# EAGLE design connector-test (EAGLE 9.1.2)
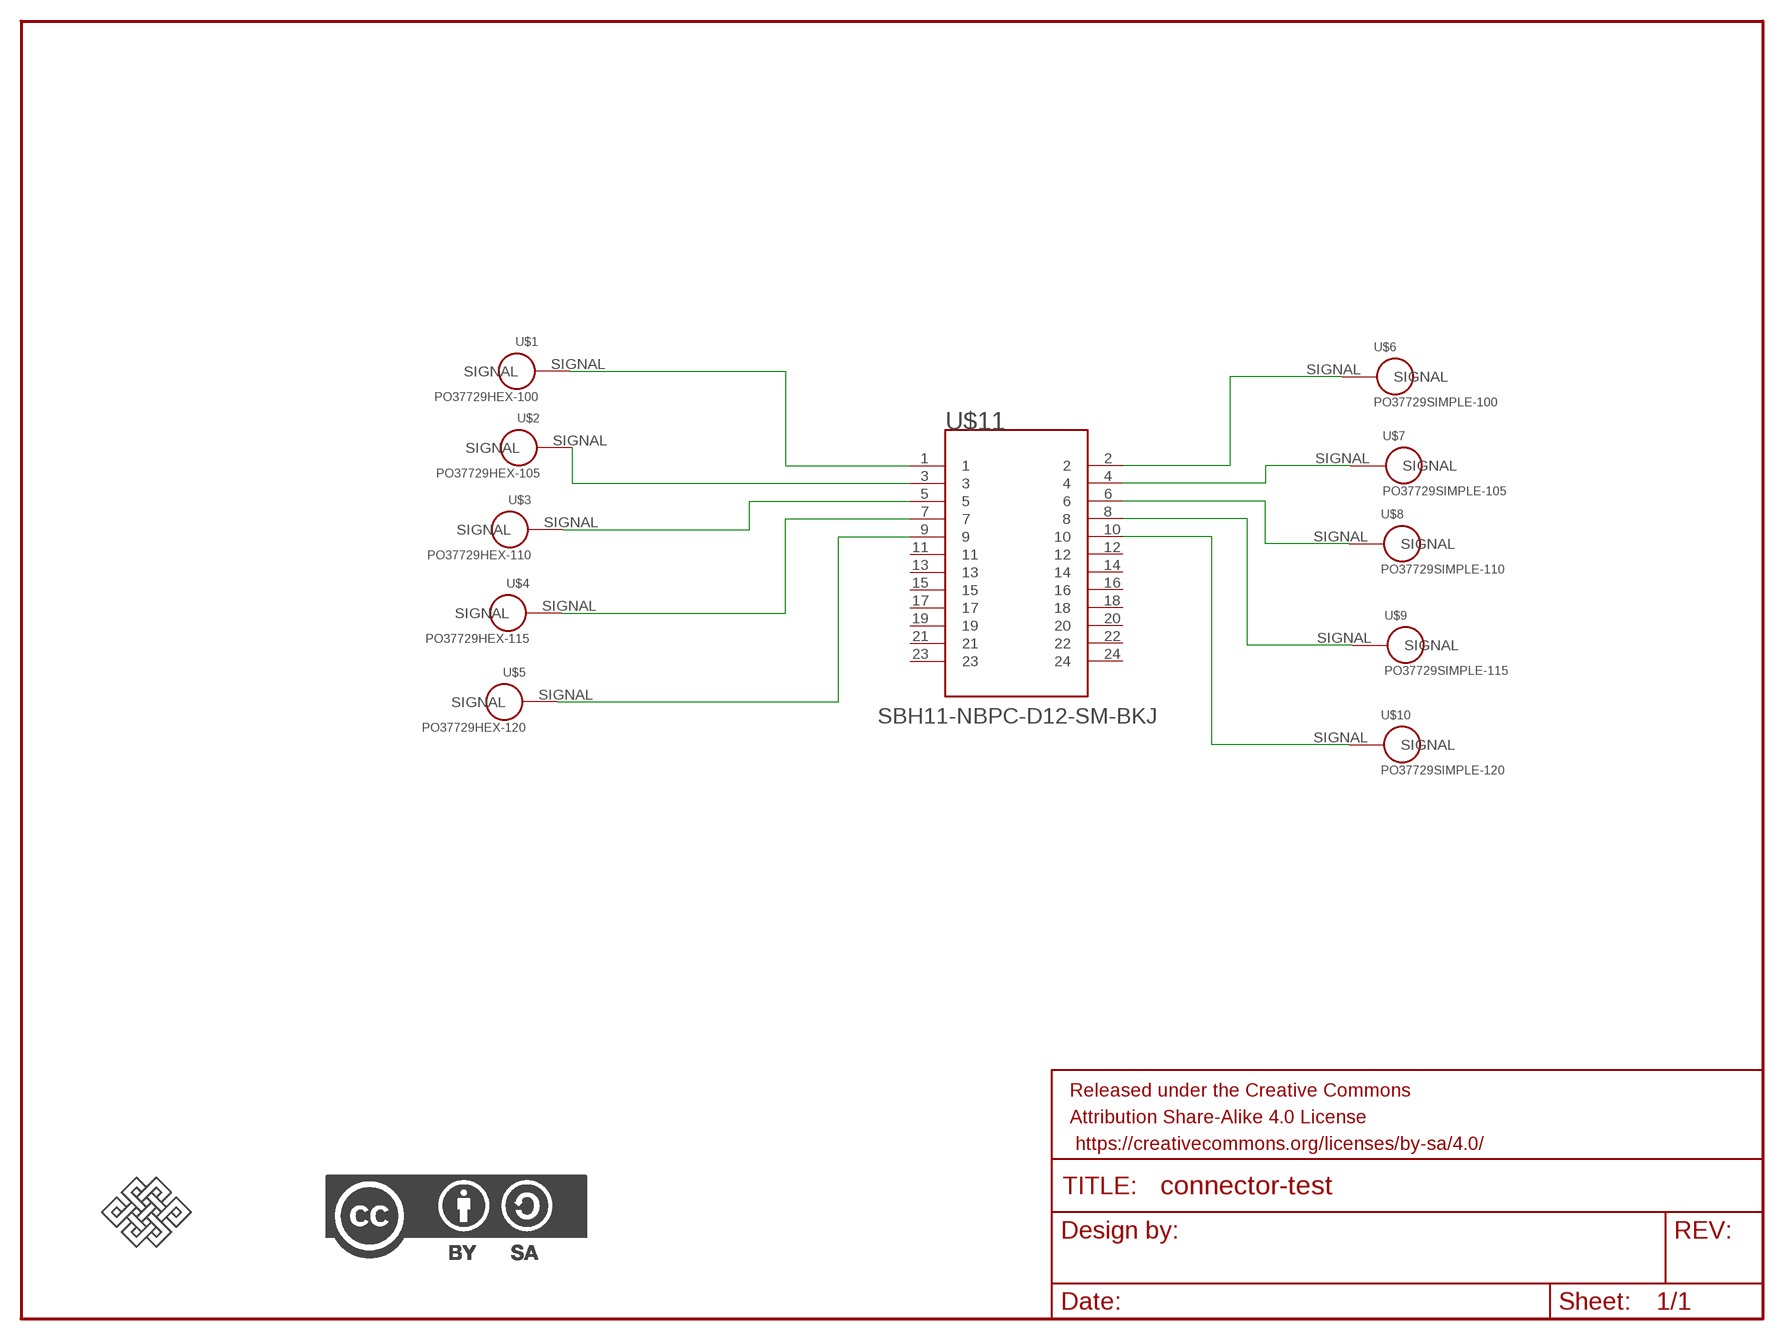
[diagram p0: schematic, sheet 1]

## Parts
FRAME1  FRAME-LETTER  [CREATIVE_COMMONS]
U$1  PO37729HEX-100  [HEX-100]
U$2  PO37729HEX-105  [HEX-105]
U$3  PO37729HEX-110  [HEX-110]
U$4  PO37729HEX-115  [HEX-115]
U$5  PO37729HEX-120  [HEX-120]
U$6  PO37729SIMPLE-100  [SIMPLE-100]
U$7  PO37729SIMPLE-105  [SIMPLE-105]
U$8  PO37729SIMPLE-110  [SIMPLE-110]
U$9  PO37729SIMPLE-115  [SIMPLE-115]
U$10  PO37729SIMPLE-120  [SIMPLE-120]
U$11  SBH11-NBPC-D12-SM-BKJ  [SBH11-NBPC-D12-SM-BK]
U$12  ENDLESSKNOTENDLESSKNOT-LARGE  [ENDLESSKNOT]
U$13  CC-BY-SA  [CC-BY-SA]

## Nets
N$1: U$1.SIGNAL U$11.1
N$2: U$2.SIGNAL U$11.3
N$3: U$3.SIGNAL U$11.5
N$4: U$4.SIGNAL U$11.7
N$5: U$5.SIGNAL U$11.9
N$6: U$6.SIGNAL U$11.2
N$7: U$7.SIGNAL U$11.4
N$8: U$8.SIGNAL U$11.6
N$9: U$9.SIGNAL U$11.8
N$10: U$10.SIGNAL U$11.10
Unconnected: U$11.11 U$11.12 U$11.13 U$11.14 U$11.15 U$11.16 U$11.17 U$11.18 U$11.19 U$11.20 U$11.21 U$11.22 U$11.23 U$11.24

## Library data of the parts
FRAME1 = SparkFun-Aesthetics:FRAME-LETTER: Schematic Frame - Letter Standard 8.5x11 US Letter frame
U$1-U$10 = po-37729:PO37729: Plastics One 37729 - DIN 42-802 female vertical jack
U$11 = SBH11-NBPC-D12-SM-BK:SBH11-NBPC-D12-SM-BK: Sullins 24 postion SMT shrouded header SBH11-NBPC-D12-SM-BK; AUTHOR: Adam Feuer; AVAILABILITY: Current; DESCRIPTION: Sullins 24 postion SMT shrouded header SBH11-NBPC-D12-SM-BK; MF: SULLINS; MP: SBH11-NBPC-D12-SM-BK; PACKAGE: None; PRICE: 0.00 USD
U$12 = endless-knot:ENDLESSKNOT
U$13 = creative-commons:CC-BY-SA: CC-BY-SA logo

## Board
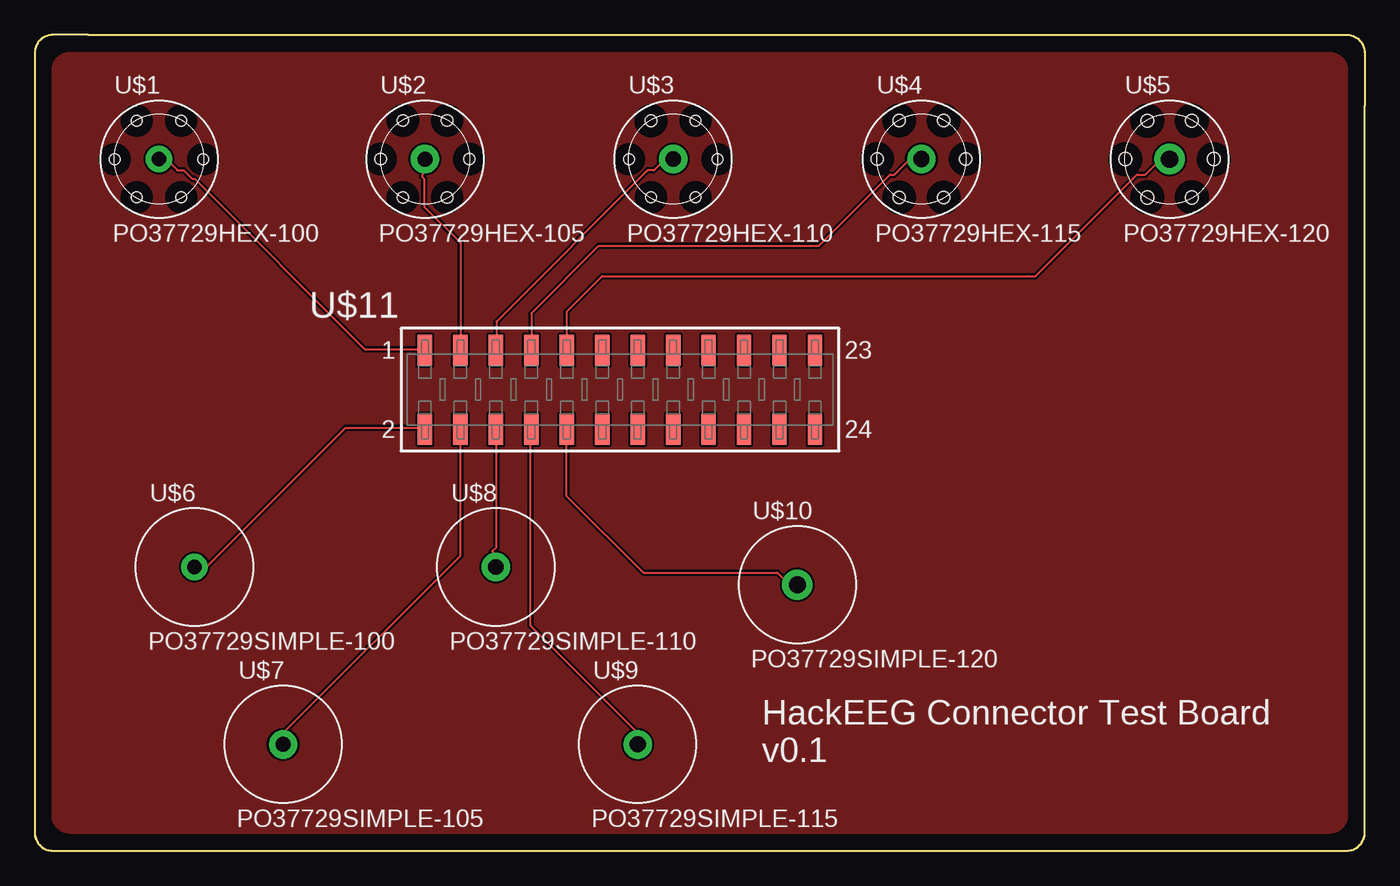
[diagram p1: board, top side]
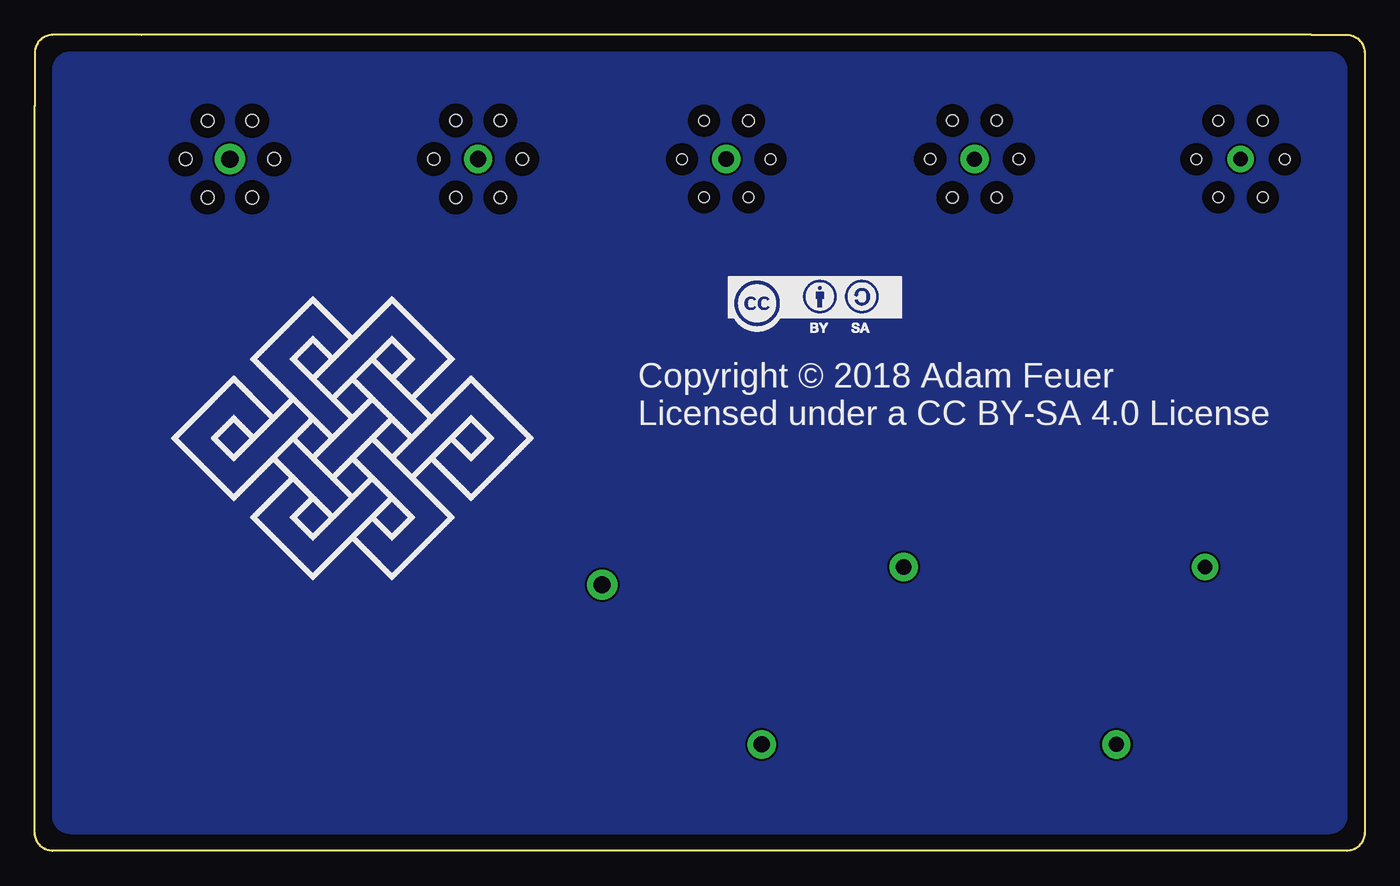
[diagram p2: board, bottom side, seen from below]

Size 95.25 x 58.42 mm. Coordinates in mm from the lower left corner, seen from the top.
Outline: 3.81,58.42 87.63,58.42 93.98,58.42 arc-90 95.25,57.15 95.25,53.34 95.25,1.27 arc-90 93.98,0 1.27,0 arc-90 0,1.27 0,57.15 arc-90 1.27,58.42 3.81,58.42
Copper layers (1*16): Top 0.035mm / dielectric 1.5mm / Bottom 0.035mm
Design rules "default *": minimum track width 6mil, minimum drill 0.35mm, track to track 6mil, track to pad 6mil, pad to pad 6mil, via to via 6mil, smd to smd 6mil, copper to edge 30mil, drill to drill 8mil, minimum pad ring 10mil, minimum via ring 8mil, stop-mask expansion 4mil, vias tented up to drill 0mil, thermal gap 10mil

### Footprints (pad centres in the part's own frame; a part is rotated, then mirrored left to right if it is on the bottom)
HEX-100 = drill 1.016 pad 1.905: SIGNAL 0,0 | hole 0.762: -3.175,0; -1.587,-2.75; 1.587,2.75; 3.175,0; 1.587,-2.75; -1.587,2.75
HEX-105 = drill 1.067 pad 2.032: SIGNAL 0,0 | hole 0.8: -3.175,0; -1.587,-2.75; 1.587,2.75; 3.175,0; 1.587,-2.75; -1.587,2.75
HEX-110 = drill 1.118 pad 2.032: SIGNAL 0,0 | hole 0.762: -3.175,0; -1.587,-2.75; 1.587,2.75; 3.175,0; 1.587,-2.75 | hole 0.838: -1.587,2.75
HEX-115 = drill 1.168 pad 2.032: SIGNAL 0,0 | hole 0.876: -3.175,0; -1.587,-2.75; 1.587,2.75; 3.175,0; 1.587,-2.75; -1.587,2.75
HEX-120 = drill 1.219 pad 2.159: SIGNAL 0,0 | hole 0.914: -3.175,0; -1.587,-2.75; 1.587,2.75; 3.175,0; 1.587,-2.75; -1.587,2.75
SIMPLE-100 = drill 1.016 pad 1.905: SIGNAL 0,0
SIMPLE-105 = drill 1.067 pad 2.032: SIGNAL 0,0
SIMPLE-110 = drill 1.118 pad 2.032: SIGNAL 0,0
SIMPLE-115 = drill 1.168 pad 2.032: SIGNAL 0,0
SIMPLE-120 = drill 1.219 pad 2.159: SIGNAL 0,0
SBH11-NBPC-D12-SM-BK = smd 1.02 x 2.22: 1 -13.97,2.826; 2 -13.97,-2.826; 3 -11.43,2.826; 4 -11.43,-2.826; 5 -8.89,2.826; 6 -8.89,-2.826; 7 -6.35,2.826; 8 -6.35,-2.826; 9 -3.81,2.826; 10 -3.81,-2.826; 11 -1.27,2.826; 12 -1.27,-2.826; 13 1.27,2.826; 14 1.27,-2.826; 15 3.81,2.826; 16 3.81,-2.826; 17 6.35,2.826; 18 6.35,-2.826; 19 8.89,2.826; 20 8.89,-2.826; 21 11.43,2.826; 22 11.43,-2.826; 23 13.97,2.826; 24 13.97,-2.826

### Placement (x,y rotation side)
FRAME1  -83.82,24.13 0 top  (outside the outline)
U$1  8.89,49.53 0 top
U$2  27.94,49.53 0 top
U$3  45.72,49.53 0 top
U$4  63.5,49.53 0 top
U$5  81.28,49.53 0 top
U$6  11.43,20.32 0 top
U$7  17.78,7.62 0 top
U$8  33.02,20.32 0 top
U$9  43.18,7.62 0 top
U$10  54.61,19.05 0 top
U$11  41.91,33.02 0 top
U$12  72.39,29.21 0 bottom
U$13  45.72,36.83 0 bottom

### Tracks (layer width: path | path; a pad name or v marks a point on that pad's centre or on a via)
GND
  pour Bottom: 7.62,57.15 88.9,57.15 92.71,57.15 arc-90 93.98,55.88 93.98,7.62 93.98,2.54 arc-90 92.71,1.27 6.35,1.27 2.54,1.27 arc-90 1.27,2.54 1.27,50.8 1.27,55.88 arc-90 2.54,57.15
N$1
  Top 0.152: U$11.1 27.89,35.92 23.62,35.92 11.43,48.11 11.28,48.11 10.67,48.72 10.21,48.72 9.45,49.48 8.99,49.48 U$1.SIGNAL
N$2
  Top 0.152: U$11.3 30.48,35.92 30.48,43.54 27.89,46.13 27.89,48.11 27.74,48.26 27.74,48.41 27.89,48.56 27.89,49.48 U$2.SIGNAL
N$3
  Top 0.152: U$11.5 33.07,35.92 33.07,37.9 43.89,48.72 44.35,48.72 45.11,49.48 45.72,49.48 U$3.SIGNAL
N$4
  Top 0.152: U$4.SIGNAL 63.4,49.48 62.64,49.48 61.57,48.41 61.27,48.41 56.16,43.31 | 55.88,43.31 40.39,43.31 35.56,38.48 U$11.7 | 55.88,43.31 56.16,43.31 | 55.88,43.31 56.16,43.31
N$5
  Top 0.152: U$5.SIGNAL 81.23,49.48 80.62,49.48 79.55,48.41 78.94,48.41 71.68,41.15 | 71.12,41.15 40.64,41.15 38.1,38.61 U$11.9 | 71.12,41.15 71.68,41.15 | 71.12,41.15 71.68,41.15
N$6
  Top 0.152: U$11.2 27.89,30.28 22.25,30.28 12.34,20.37 11.43,20.37 U$6.SIGNAL
N$7
  Top 0.152: U$11.4 30.48,30.12 30.48,21.13 17.83,8.48 17.83,7.72 U$7.SIGNAL
N$8
  Top 0.152: U$11.6 33.07,30.12 33.07,21.74 32.77,21.44 32.92,21.28 32.92,20.37 U$8.SIGNAL
N$9
  Top 0.152: U$11.8 35.51,30.12 35.51,16.1 43.13,8.48 43.13,7.72 U$9.SIGNAL
N$10
  Top 0.152: U$10.SIGNAL 54.56,19.15 53.95,19.15 53.19,19.91 43.59,19.91 38.1,25.4 U$11.10
VCC
  pour Top: 8.89,57.15 83.82,57.15 92.71,57.15 arc-90 93.98,55.88 93.98,8.89 93.98,2.54 arc-90 92.71,1.27 5.08,1.27 2.54,1.27 arc-90 1.27,2.54 1.27,53.34 1.27,55.88 arc-90 2.54,57.15

### Text on the board
tNames: HackEEG Connector Test Board / v0.1
bNames: Copyright © 2018 Adam Feuer / Licensed under a CC BY-SA 4.0 License